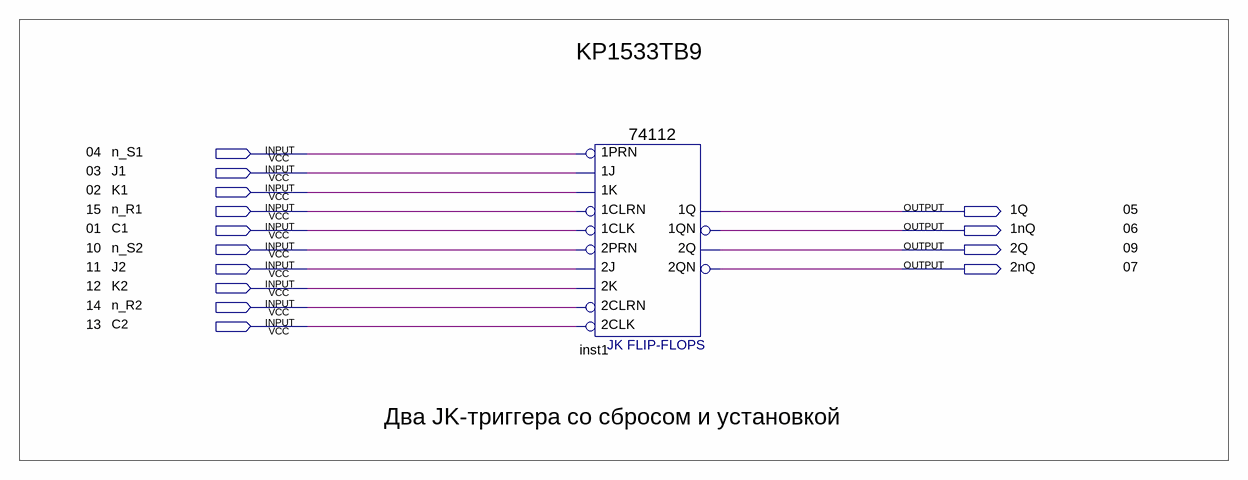
[diagram p0: schematic sheet]
// Quartus schematic KP1533TB9.bdf as structural Verilog: 1 symbols, 14 pins
module KP1533TB9 (
  input  n_S1,
  input  J1,
  input  K1,
  input  n_R1,
  input  C1,
  input  n_S2,
  input  J2,
  input  K2,
  input  n_R2,
  input  C2,
  output \1Q ,
  output \1nQ ,
  output \2Q ,
  output \2nQ 
);

  \74112  inst1 (
    .\1K (K1), .\1J (J1), .\1PRN (n_S1), .\1CLK (C1), .\1CLRN (n_R1), .\2K (K2), .\2J (J2), .\2PRN (n_S2),
    .\2CLK (C2), .\2CLRN (n_R2), .\1QN (\1nQ ), .\2Q (\2Q ), .\1Q (\1Q ), .\2QN (\2nQ ));

  // Notes on the sheet:
  //   KP1533ТВ9
  //   04
  //   03
  //   02
  //   15
  //   05
  //   01
  //   06
  //   10
  //   09
  //   11
  //   07
  //   12
  //   14
  //   13
  //   Два JK-триггера со сбросом и установкой
endmodule
